# EAGLE schematic projekt_oswietlenia (EAGLE 8.5.2)

## Sheet 1 of 3
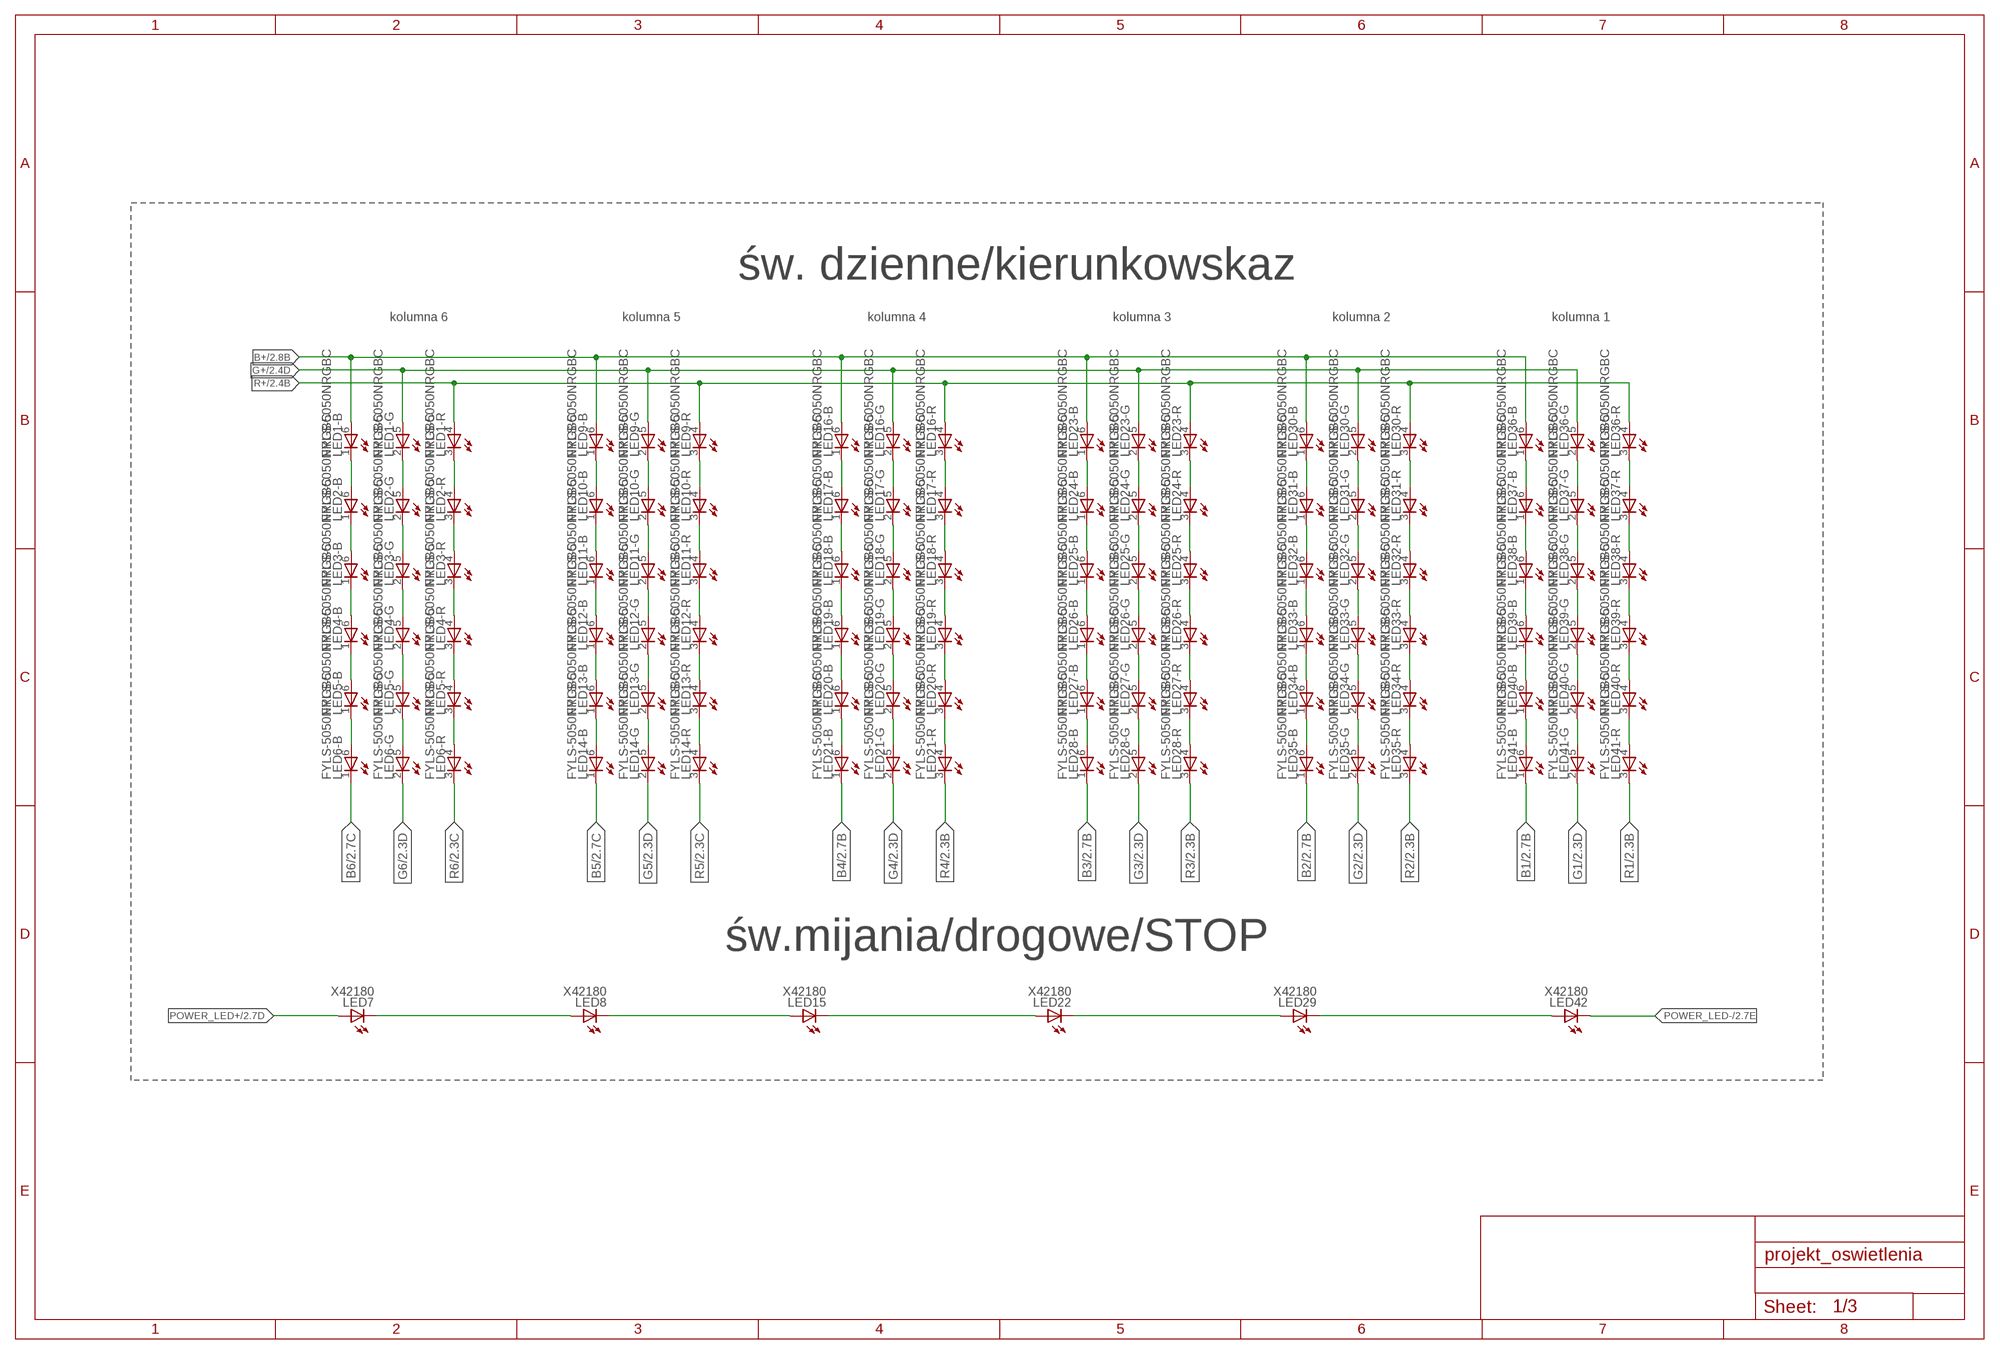
[diagram p0: schematic, sheet 1]

### Parts
LED1  FYLS-5050NRGBC  OVSTRGBBCR8  [OVSTRGBBCR8]
LED2  FYLS-5050NRGBC  OVSTRGBBCR8  [OVSTRGBBCR8]
LED3  FYLS-5050NRGBC  OVSTRGBBCR8  [OVSTRGBBCR8]
LED4  FYLS-5050NRGBC  OVSTRGBBCR8  [OVSTRGBBCR8]
LED5  FYLS-5050NRGBC  OVSTRGBBCR8  [OVSTRGBBCR8]
LED6  FYLS-5050NRGBC  OVSTRGBBCR8  [OVSTRGBBCR8]
LED7  X42180  [Z-POWER-LED-DOME-TYPE]
LED8  X42180  [Z-POWER-LED-DOME-TYPE]
LED9  FYLS-5050NRGBC  OVSTRGBBCR8  [OVSTRGBBCR8]
LED10  FYLS-5050NRGBC  OVSTRGBBCR8  [OVSTRGBBCR8]
LED11  FYLS-5050NRGBC  OVSTRGBBCR8  [OVSTRGBBCR8]
LED12  FYLS-5050NRGBC  OVSTRGBBCR8  [OVSTRGBBCR8]
LED13  FYLS-5050NRGBC  OVSTRGBBCR8  [OVSTRGBBCR8]
LED14  FYLS-5050NRGBC  OVSTRGBBCR8  [OVSTRGBBCR8]
LED15  X42180  [Z-POWER-LED-DOME-TYPE]
LED16  FYLS-5050NRGBC  OVSTRGBBCR8  [OVSTRGBBCR8]
LED17  FYLS-5050NRGBC  OVSTRGBBCR8  [OVSTRGBBCR8]
LED18  FYLS-5050NRGBC  OVSTRGBBCR8  [OVSTRGBBCR8]
LED19  FYLS-5050NRGBC  OVSTRGBBCR8  [OVSTRGBBCR8]
LED20  FYLS-5050NRGBC  OVSTRGBBCR8  [OVSTRGBBCR8]
LED21  FYLS-5050NRGBC  OVSTRGBBCR8  [OVSTRGBBCR8]
LED22  X42180  [Z-POWER-LED-DOME-TYPE]
LED23  FYLS-5050NRGBC  OVSTRGBBCR8  [OVSTRGBBCR8]
LED24  FYLS-5050NRGBC  OVSTRGBBCR8  [OVSTRGBBCR8]
LED25  FYLS-5050NRGBC  OVSTRGBBCR8  [OVSTRGBBCR8]
LED26  FYLS-5050NRGBC  OVSTRGBBCR8  [OVSTRGBBCR8]
LED27  FYLS-5050NRGBC  OVSTRGBBCR8  [OVSTRGBBCR8]
LED28  FYLS-5050NRGBC  OVSTRGBBCR8  [OVSTRGBBCR8]
LED29  X42180  [Z-POWER-LED-DOME-TYPE]
LED30  FYLS-5050NRGBC  OVSTRGBBCR8  [OVSTRGBBCR8]
LED31  FYLS-5050NRGBC  OVSTRGBBCR8  [OVSTRGBBCR8]
LED32  FYLS-5050NRGBC  OVSTRGBBCR8  [OVSTRGBBCR8]
LED33  FYLS-5050NRGBC  OVSTRGBBCR8  [OVSTRGBBCR8]
LED34  FYLS-5050NRGBC  OVSTRGBBCR8  [OVSTRGBBCR8]
LED35  FYLS-5050NRGBC  OVSTRGBBCR8  [OVSTRGBBCR8]
LED36  FYLS-5050NRGBC  OVSTRGBBCR8  [OVSTRGBBCR8]
LED37  FYLS-5050NRGBC  OVSTRGBBCR8  [OVSTRGBBCR8]
LED38  FYLS-5050NRGBC  OVSTRGBBCR8  [OVSTRGBBCR8]
LED39  FYLS-5050NRGBC  OVSTRGBBCR8  [OVSTRGBBCR8]
LED40  FYLS-5050NRGBC  OVSTRGBBCR8  [OVSTRGBBCR8]
LED41  FYLS-5050NRGBC  OVSTRGBBCR8  [OVSTRGBBCR8]
LED42  X42180  [Z-POWER-LED-DOME-TYPE]

### Nets
B1: LED41.1(-B:C) ; also sheet 2
B2: LED35.1(-B:C) ; also sheet 2
B3: LED28.1(-B:C) ; also sheet 2
B4: LED21.1(-B:C) ; also sheet 2
B5: LED14.1(-B:C) ; also sheet 2
B6: LED6.1(-B:C) ; also sheet 2
B+: LED1.6(-B:A) LED9.6(-B:A) LED16.6(-B:A) LED23.6(-B:A) LED30.6(-B:A) LED36.6(-B:A) ; also sheet 2
G1: LED41.2(-G:C) ; also sheet 2
G2: LED35.2(-G:C) ; also sheet 2
G3: LED28.2(-G:C) ; also sheet 2
G4: LED21.2(-G:C) ; also sheet 2
G5: LED14.2(-G:C) ; also sheet 2
G6: LED6.2(-G:C) ; also sheet 2
G+: LED1.5(-G:A) LED9.5(-G:A) LED16.5(-G:A) LED23.5(-G:A) LED30.5(-G:A) LED36.5(-G:A) ; also sheet 2
N$1: LED13.3(-R:C) LED14.4(-R:A)
N$2: LED13.2(-G:C) LED14.5(-G:A)
N$3: LED13.1(-B:C) LED14.6(-B:A)
N$4: LED12.3(-R:C) LED13.4(-R:A)
N$5: LED12.2(-G:C) LED13.5(-G:A)
N$6: LED12.1(-B:C) LED13.6(-B:A)
N$7: LED11.1(-B:C) LED12.6(-B:A)
N$8: LED11.2(-G:C) LED12.5(-G:A)
N$9: LED11.3(-R:C) LED12.4(-R:A)
N$10: LED10.3(-R:C) LED11.4(-R:A)
N$11: LED10.2(-G:C) LED11.5(-G:A)
N$12: LED29.C LED42.A
N$13: LED10.1(-B:C) LED11.6(-B:A)
N$14: LED9.3(-R:C) LED10.4(-R:A)
N$15: LED9.2(-G:C) LED10.5(-G:A)
N$16: LED9.1(-B:C) LED10.6(-B:A)
N$17: LED5.3(-R:C) LED6.4(-R:A)
N$18: LED5.2(-G:C) LED6.5(-G:A)
N$19: LED5.1(-B:C) LED6.6(-B:A)
N$20: LED4.3(-R:C) LED5.4(-R:A)
N$21: LED4.2(-G:C) LED5.5(-G:A)
N$22: LED4.1(-B:C) LED5.6(-B:A)
N$23: LED3.1(-B:C) LED4.6(-B:A)
N$24: LED3.2(-G:C) LED4.5(-G:A)
N$25: LED3.3(-R:C) LED4.4(-R:A)
N$26: LED2.3(-R:C) LED3.4(-R:A)
N$27: LED2.2(-G:C) LED3.5(-G:A)
N$28: LED2.1(-B:C) LED3.6(-B:A)
N$29: LED1.3(-R:C) LED2.4(-R:A)
N$30: LED1.2(-G:C) LED2.5(-G:A)
N$31: LED1.1(-B:C) LED2.6(-B:A)
N$32: LED27.3(-R:C) LED28.4(-R:A)
N$33: LED27.2(-G:C) LED28.5(-G:A)
N$34: LED27.1(-B:C) LED28.6(-B:A)
N$35: LED26.3(-R:C) LED27.4(-R:A)
N$36: LED26.2(-G:C) LED27.5(-G:A)
N$37: LED26.1(-B:C) LED27.6(-B:A)
N$38: LED25.1(-B:C) LED26.6(-B:A)
N$39: LED25.2(-G:C) LED26.5(-G:A)
N$40: LED25.3(-R:C) LED26.4(-R:A)
N$41: LED24.3(-R:C) LED25.4(-R:A)
N$42: LED24.2(-G:C) LED25.5(-G:A)
N$43: LED24.1(-B:C) LED25.6(-B:A)
N$44: LED23.3(-R:C) LED24.4(-R:A)
N$45: LED23.2(-G:C) LED24.5(-G:A)
N$46: LED23.1(-B:C) LED24.6(-B:A)
N$47: LED20.3(-R:C) LED21.4(-R:A)
N$48: LED20.2(-G:C) LED21.5(-G:A)
N$49: LED20.1(-B:C) LED21.6(-B:A)
N$50: LED19.3(-R:C) LED20.4(-R:A)
N$51: LED19.2(-G:C) LED20.5(-G:A)
N$52: LED19.1(-B:C) LED20.6(-B:A)
N$53: LED18.1(-B:C) LED19.6(-B:A)
N$54: LED18.2(-G:C) LED19.5(-G:A)
N$55: LED18.3(-R:C) LED19.4(-R:A)
N$56: LED17.3(-R:C) LED18.4(-R:A)
N$57: LED17.2(-G:C) LED18.5(-G:A)
N$58: LED17.1(-B:C) LED18.6(-B:A)
N$59: LED16.3(-R:C) LED17.4(-R:A)
N$60: LED16.2(-G:C) LED17.5(-G:A)
N$61: LED16.1(-B:C) LED17.6(-B:A)
N$62: LED40.3(-R:C) LED41.4(-R:A)
N$63: LED40.2(-G:C) LED41.5(-G:A)
N$64: LED40.1(-B:C) LED41.6(-B:A)
N$65: LED39.3(-R:C) LED40.4(-R:A)
N$66: LED39.2(-G:C) LED40.5(-G:A)
N$67: LED39.1(-B:C) LED40.6(-B:A)
N$68: LED38.1(-B:C) LED39.6(-B:A)
N$69: LED38.2(-G:C) LED39.5(-G:A)
N$70: LED38.3(-R:C) LED39.4(-R:A)
N$71: LED37.3(-R:C) LED38.4(-R:A)
N$72: LED37.2(-G:C) LED38.5(-G:A)
N$73: LED37.1(-B:C) LED38.6(-B:A)
N$74: LED36.3(-R:C) LED37.4(-R:A)
N$75: LED36.2(-G:C) LED37.5(-G:A)
N$76: LED36.1(-B:C) LED37.6(-B:A)
N$77: LED34.3(-R:C) LED35.4(-R:A)
N$78: LED34.2(-G:C) LED35.5(-G:A)
N$79: LED34.1(-B:C) LED35.6(-B:A)
N$80: LED33.3(-R:C) LED34.4(-R:A)
N$81: LED33.2(-G:C) LED34.5(-G:A)
N$82: LED33.1(-B:C) LED34.6(-B:A)
N$83: LED32.1(-B:C) LED33.6(-B:A)
N$84: LED32.2(-G:C) LED33.5(-G:A)
N$85: LED32.3(-R:C) LED33.4(-R:A)
N$86: LED31.3(-R:C) LED32.4(-R:A)
N$87: LED31.2(-G:C) LED32.5(-G:A)
N$88: LED31.1(-B:C) LED32.6(-B:A)
N$89: LED30.3(-R:C) LED31.4(-R:A)
N$90: LED30.2(-G:C) LED31.5(-G:A)
N$91: LED30.1(-B:C) LED31.6(-B:A)
N$92: LED22.C LED29.A
N$93: LED15.C LED22.A
N$94: LED8.C LED15.A
N$95: LED7.C LED8.A
POWER_LED+: LED7.A ; also sheet 2
POWER_LED-: LED42.C ; also sheet 2
R1: LED41.3(-R:C) ; also sheet 2
R2: LED35.3(-R:C) ; also sheet 2
R3: LED28.3(-R:C) ; also sheet 2
R4: LED21.3(-R:C) ; also sheet 2
R5: LED14.3(-R:C) ; also sheet 2
R6: LED6.3(-R:C) ; also sheet 2
R+: LED1.4(-R:A) LED9.4(-R:A) LED16.4(-R:A) LED23.4(-R:A) LED30.4(-R:A) LED36.4(-R:A) ; also sheet 2

### Notes on the sheet
- św. dzienne/kierunkowskaz
- kolumna 6 | kolumna 5 | kolumna 4 | kolumna 3 | kolumna 2 | kolumna 1
- św.mijania/drogowe/STOP

## Sheet 2 of 3
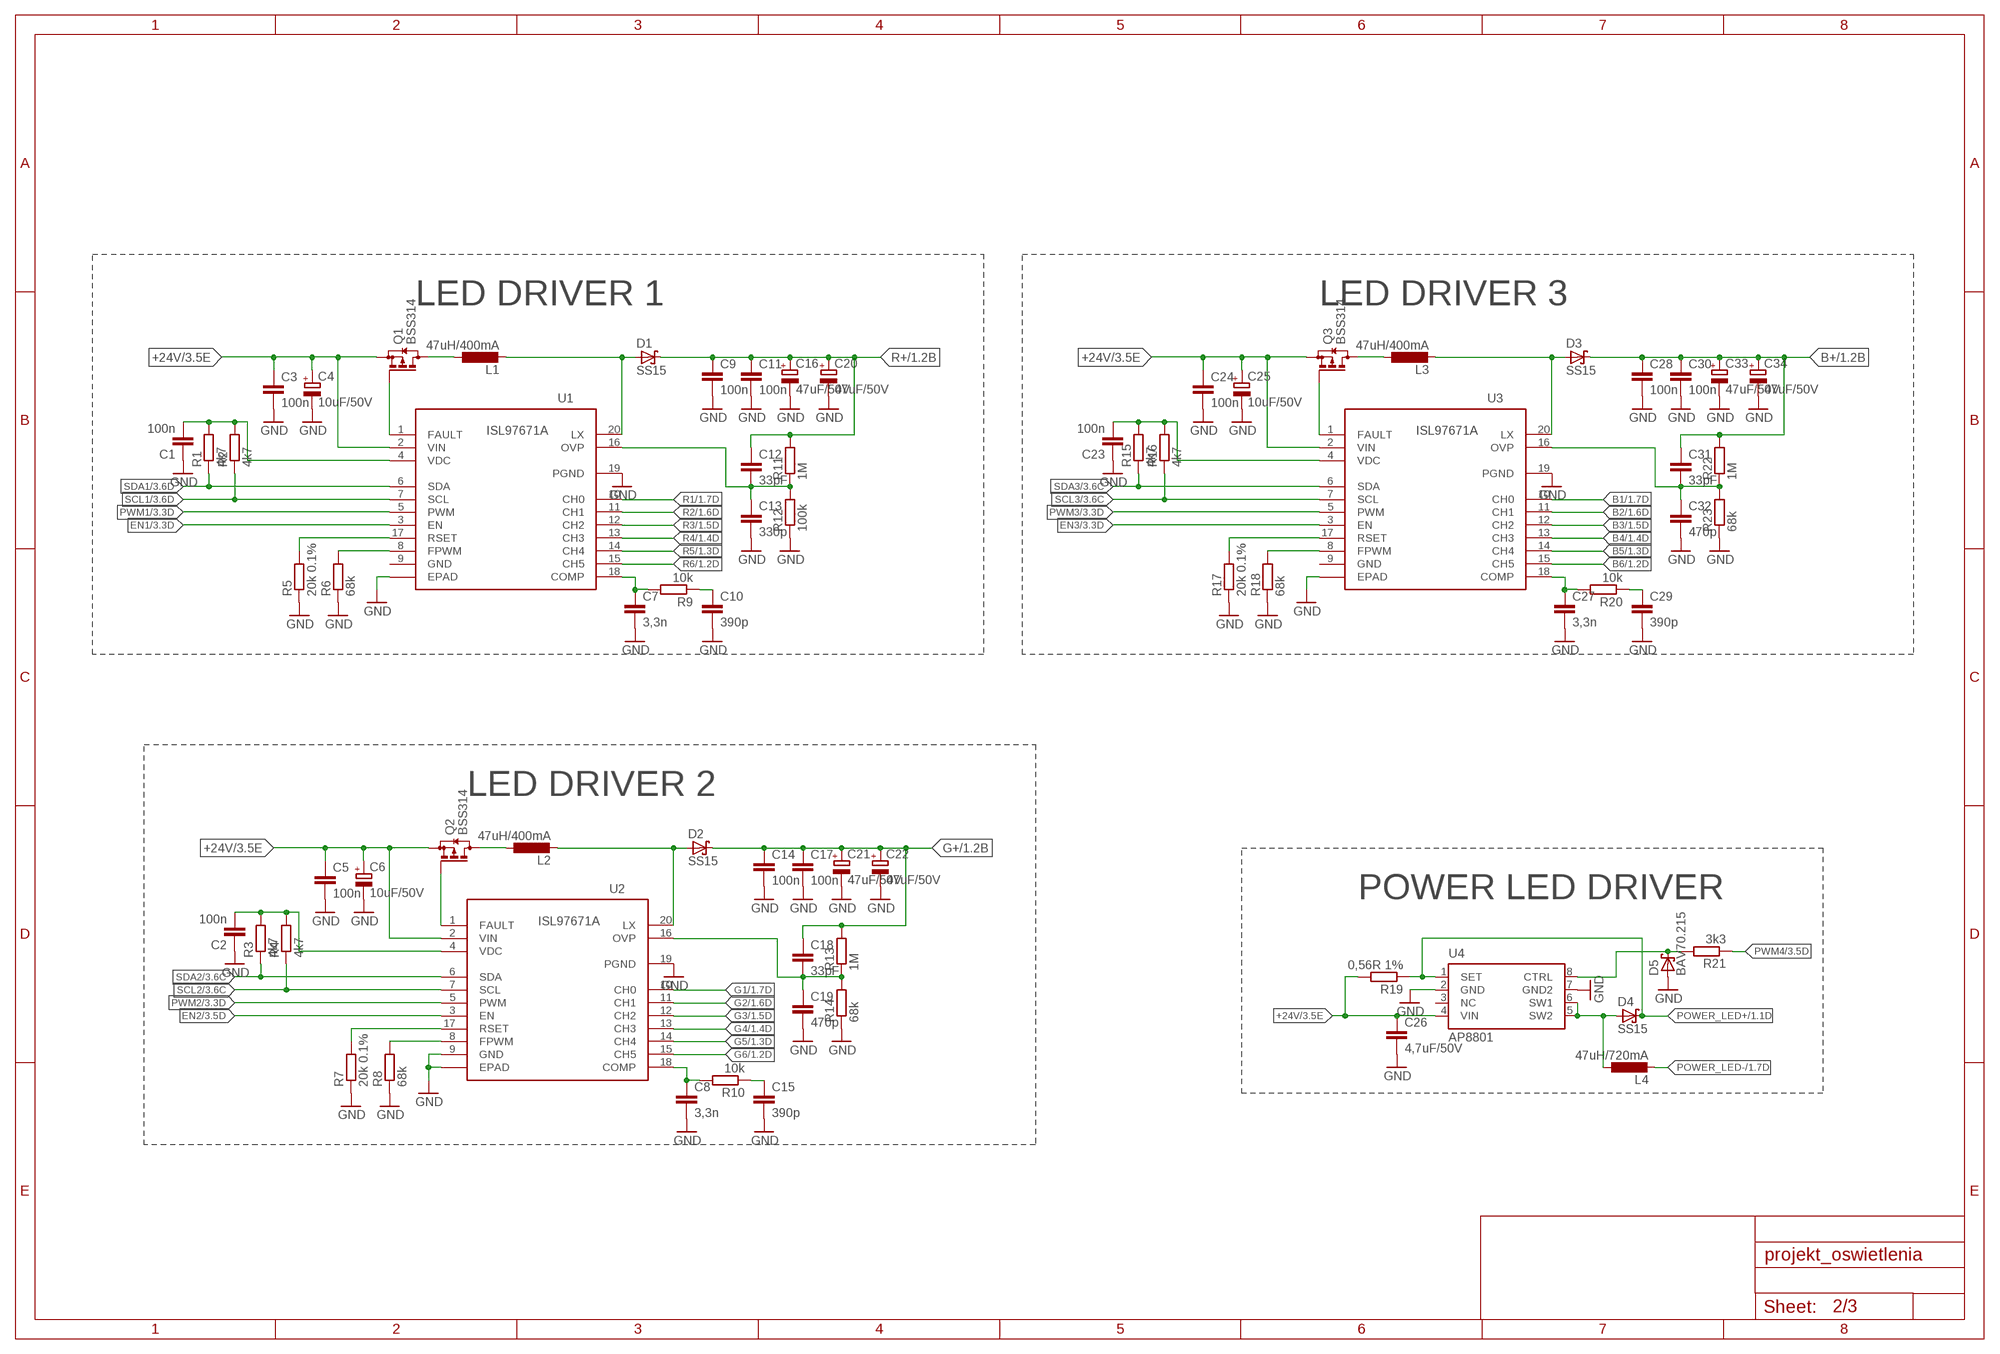
[diagram p1: schematic, sheet 2]

### Parts
C1  100n  C-EUC0603  [C0603]
C2  100n  C-EUC0603  [C0603]
C3  100n  C-EUC0603  [C0603]
C4  10uF/50V  CPOL-EU153CLV-0605  [153CLV-0605]
C5  100n  C-EUC0603  [C0603]
C6  10uF/50V  CPOL-EU153CLV-0605  [153CLV-0605]
C7  3,3n  C-EUC0603  [C0603]
C8  3,3n  C-EUC0603  [C0603]
C9  100n  C-EUC0603  [C0603]
C10  390p  C-EUC0603  [C0603]
C11  100n  C-EUC0603  [C0603]
C12  33pF  C-EUC0603  [C0603]
C13  330p  C-EUC0603  [C0603]
C14  100n  C-EUC0603  [C0603]
C15  390p  C-EUC0603  [C0603]
C16  47uF/50V  CPOL-EU153CLV-0605  [153CLV-0605]
C17  100n  C-EUC0603  [C0603]
C18  33pF  C-EUC0603  [C0603]
C19  470p  C-EUC0603  [C0603]
C20  47uF/50V  CPOL-EU153CLV-0605  [153CLV-0605]
C21  47uF/50V  CPOL-EU153CLV-0605  [153CLV-0605]
C22  47uF/50V  CPOL-EU153CLV-0605  [153CLV-0605]
C23  100n  C-EUC0603  [C0603]
C24  100n  C-EUC0603  [C0603]
C25  10uF/50V  CPOL-EU153CLV-0605  [153CLV-0605]
C26  4,7uF/50V  C-EUC0603  [C0603]
C27  3,3n  C-EUC0603  [C0603]
C28  100n  C-EUC0603  [C0603]
C29  390p  C-EUC0603  [C0603]
C30  100n  C-EUC0603  [C0603]
C31  33pF  C-EUC0603  [C0603]
C32  470p  C-EUC0603  [C0603]
C33  47uF/50V  CPOL-EU153CLV-0605  [153CLV-0605]
C34  47uF/50V  CPOL-EU153CLV-0605  [153CLV-0605]
D1  SS15  [DO-214AC]
D2  SS15  [DO-214AC]
D3  SS15  [DO-214AC]
D4  SS15  [DO-214AC]
D5  BAV70.215  BAS40  [SOT23]
L1  47uH/400mA  L-EUWE-TPC  [POWER-CHOKE_WE-TPC]
L2  47uH/400mA  L-EUWE-TPC  [POWER-CHOKE_WE-TPC]
L3  47uH/400mA  L-EUWE-TPC  [POWER-CHOKE_WE-TPC]
L4  47uH/720mA  L-EUWE-TPC  [POWER-CHOKE_WE-TPC]
Q1  BSS314  BSS84  [SOT23]
Q2  BSS314  BSS84  [SOT23]
Q3  BSS314  BSS84  [SOT23]
R1  4k7  R-EU_R0603  [R0603]
R2  4k7  R-EU_R0603  [R0603]
R3  4k7  R-EU_R0603  [R0603]
R4  4k7  R-EU_R0603  [R0603]
R5  20k 0.1%  R-EU_R0603  [R0603]
R6  68k  R-EU_R0603  [R0603]
R7  20k 0.1%  R-EU_R0603  [R0603]
R8  68k  R-EU_R0603  [R0603]
R9  10k  R-EU_R0603  [R0603]
R10  10k  R-EU_R0603  [R0603]
R11  1M  R-EU_R0603  [R0603]
R12  100k  R-EU_R0603  [R0603]
R13  1M  R-EU_R0603  [R0603]
R14  68k  R-EU_R0603  [R0603]
R15  4k7  R-EU_R0603  [R0603]
R16  4k7  R-EU_R0603  [R0603]
R17  20k 0.1%  R-EU_R0603  [R0603]
R18  68k  R-EU_R0603  [R0603]
R19  0,56R 1%  R-EU_R0603  [R0603]
R20  10k  R-EU_R0603  [R0603]
R21  3k3  R-EU_R0603  [R0603]
R22  1M  R-EU_R0603  [R0603]
R23  68k  R-EU_R0603  [R0603]
U1  ISL97671A  [QFN20]
U2  ISL97671A  [QFN20]
U3  ISL97671A  [QFN20]
U4  AP8801  [SOP-08]

### Nets
+24V: C3.1 C4.+ C5.1 C6.+ C24.1 C25.+ C26.1 Q1.2(S) Q2.2(S) Q3.2(S) R19.2 U1.2(VIN) U2.2(VIN) U3.2(VIN) U4.4(VIN) ; also sheet 3
B1: U3.10(CH0) ; also sheet 1
B2: U3.11(CH1) ; also sheet 1
B3: U3.12(CH2) ; also sheet 1
B4: U3.13(CH3) ; also sheet 1
B5: U3.14(CH4) ; also sheet 1
B6: U3.15(CH5) ; also sheet 1
B+: C28.1 C30.1 C31.1 C33.+ C34.+ D3.C R22.2 ; also sheet 1
EN1: U1.3(EN) ; also sheet 3
EN2: U2.3(EN) ; also sheet 3
EN3: U3.3(EN) ; also sheet 3
G1: U2.10(CH0) ; also sheet 1
G2: U2.11(CH1) ; also sheet 1
G3: U2.12(CH2) ; also sheet 1
G4: U2.13(CH3) ; also sheet 1
G5: U2.14(CH4) ; also sheet 1
G6: U2.15(CH5) ; also sheet 1
G+: C14.1 C17.1 C18.1 C21.+ C22.+ D2.C R13.2 ; also sheet 1
GND: C1.1 C2.1 C3.2 C4.- C5.2 C6.- C7.2 C8.2 C9.2 C10.2 C11.2 C13.2 C14.2 C15.2 C16.- C17.2 C19.2 C20.- C21.- C22.- C23.1 C24.2 C25.- C26.2 C27.2 C28.2 C29.2 C30.2 C32.2 C33.- C34.- D5.1(A) R5.1 R6.1 R7.1 R8.1 R12.1 R14.1 R17.1 R18.1 R23.1 U1.19(PGND) U1.EPAD U2.9(GND) U2.19(PGND) U2.EPAD U3.19(PGND) U3.EPAD U4.2(GND) U4.7(GND2) ; also sheet 3
N$96: D4.A L4.1 U4.5(SW2) U4.6(SW1)
N$106: D5.3(C) R21.2 U4.8(CTRL)
N$114: Q3.1(G) U3.1(FAULT)
N$115: L3.1 Q3.3(D)
N$116: D3.A L3.2 U3.20(LX)
N$117: C31.2 C32.1 R22.1 R23.2 U3.16(OVP)
N$118: C27.1 R20.2 U3.18(COMP)
N$119: C29.1 R20.1
N$120: R18.2 U3.8(FPWM)
N$121: R17.2 U3.17(RSET)
N$122: Q1.1(G) U1.1(FAULT)
N$125: L1.1 Q1.3(D)
N$126: D1.A L1.2 U1.20(LX)
N$127: C12.2 C13.1 R11.1 R12.2 U1.16(OVP)
N$128: C7.1 R9.2 U1.18(COMP)
N$129: C10.1 R9.1
N$130: R6.2 U1.8(FPWM)
N$131: C23.2 R15.2 R16.2 U3.4(VDC)
N$133: R5.2 U1.17(RSET)
N$134: C1.2 R1.2 R2.2 U1.4(VDC)
N$138: Q2.1(G) U2.1(FAULT)
N$140: L2.1 Q2.3(D)
N$141: D2.A L2.2 U2.20(LX)
N$142: C18.2 C19.1 R13.1 R14.2 U2.16(OVP)
N$143: C8.1 R10.2 U2.18(COMP)
N$144: C15.1 R10.1
N$145: R8.2 U2.8(FPWM)
N$146: R7.2 U2.17(RSET)
N$147: C2.2 R3.2 R4.2 U2.4(VDC)
POWER_LED+: D4.C R19.1 U4.1(SET) ; also sheet 1
POWER_LED-: L4.2 ; also sheet 1
PWM1: U1.5(PWM) ; also sheet 3
PWM2: U2.5(PWM) ; also sheet 3
PWM3: U3.5(PWM) ; also sheet 3
PWM4: R21.1 ; also sheet 3
R1: U1.10(CH0) ; also sheet 1
R2: U1.11(CH1) ; also sheet 1
R3: U1.12(CH2) ; also sheet 1
R4: U1.13(CH3) ; also sheet 1
R5: U1.14(CH4) ; also sheet 1
R6: U1.15(CH5) ; also sheet 1
R+: C9.1 C11.1 C12.1 C16.+ C20.+ D1.C R11.2 ; also sheet 1
SCL1: R2.1 U1.7(SCL) ; also sheet 3
SCL2: R4.1 U2.7(SCL) ; also sheet 3
SCL3: R16.1 U3.7(SCL) ; also sheet 3
SDA1: R1.1 U1.6(SDA) ; also sheet 3
SDA2: R3.1 U2.6(SDA) ; also sheet 3
SDA3: R15.1 U3.6(SDA) ; also sheet 3
Unconnected: U4.3(NC)

### Notes on the sheet
- LED DRIVER 1 | LED DRIVER 3
- LED DRIVER 2
- POWER LED DRIVER

## Sheet 3 of 3
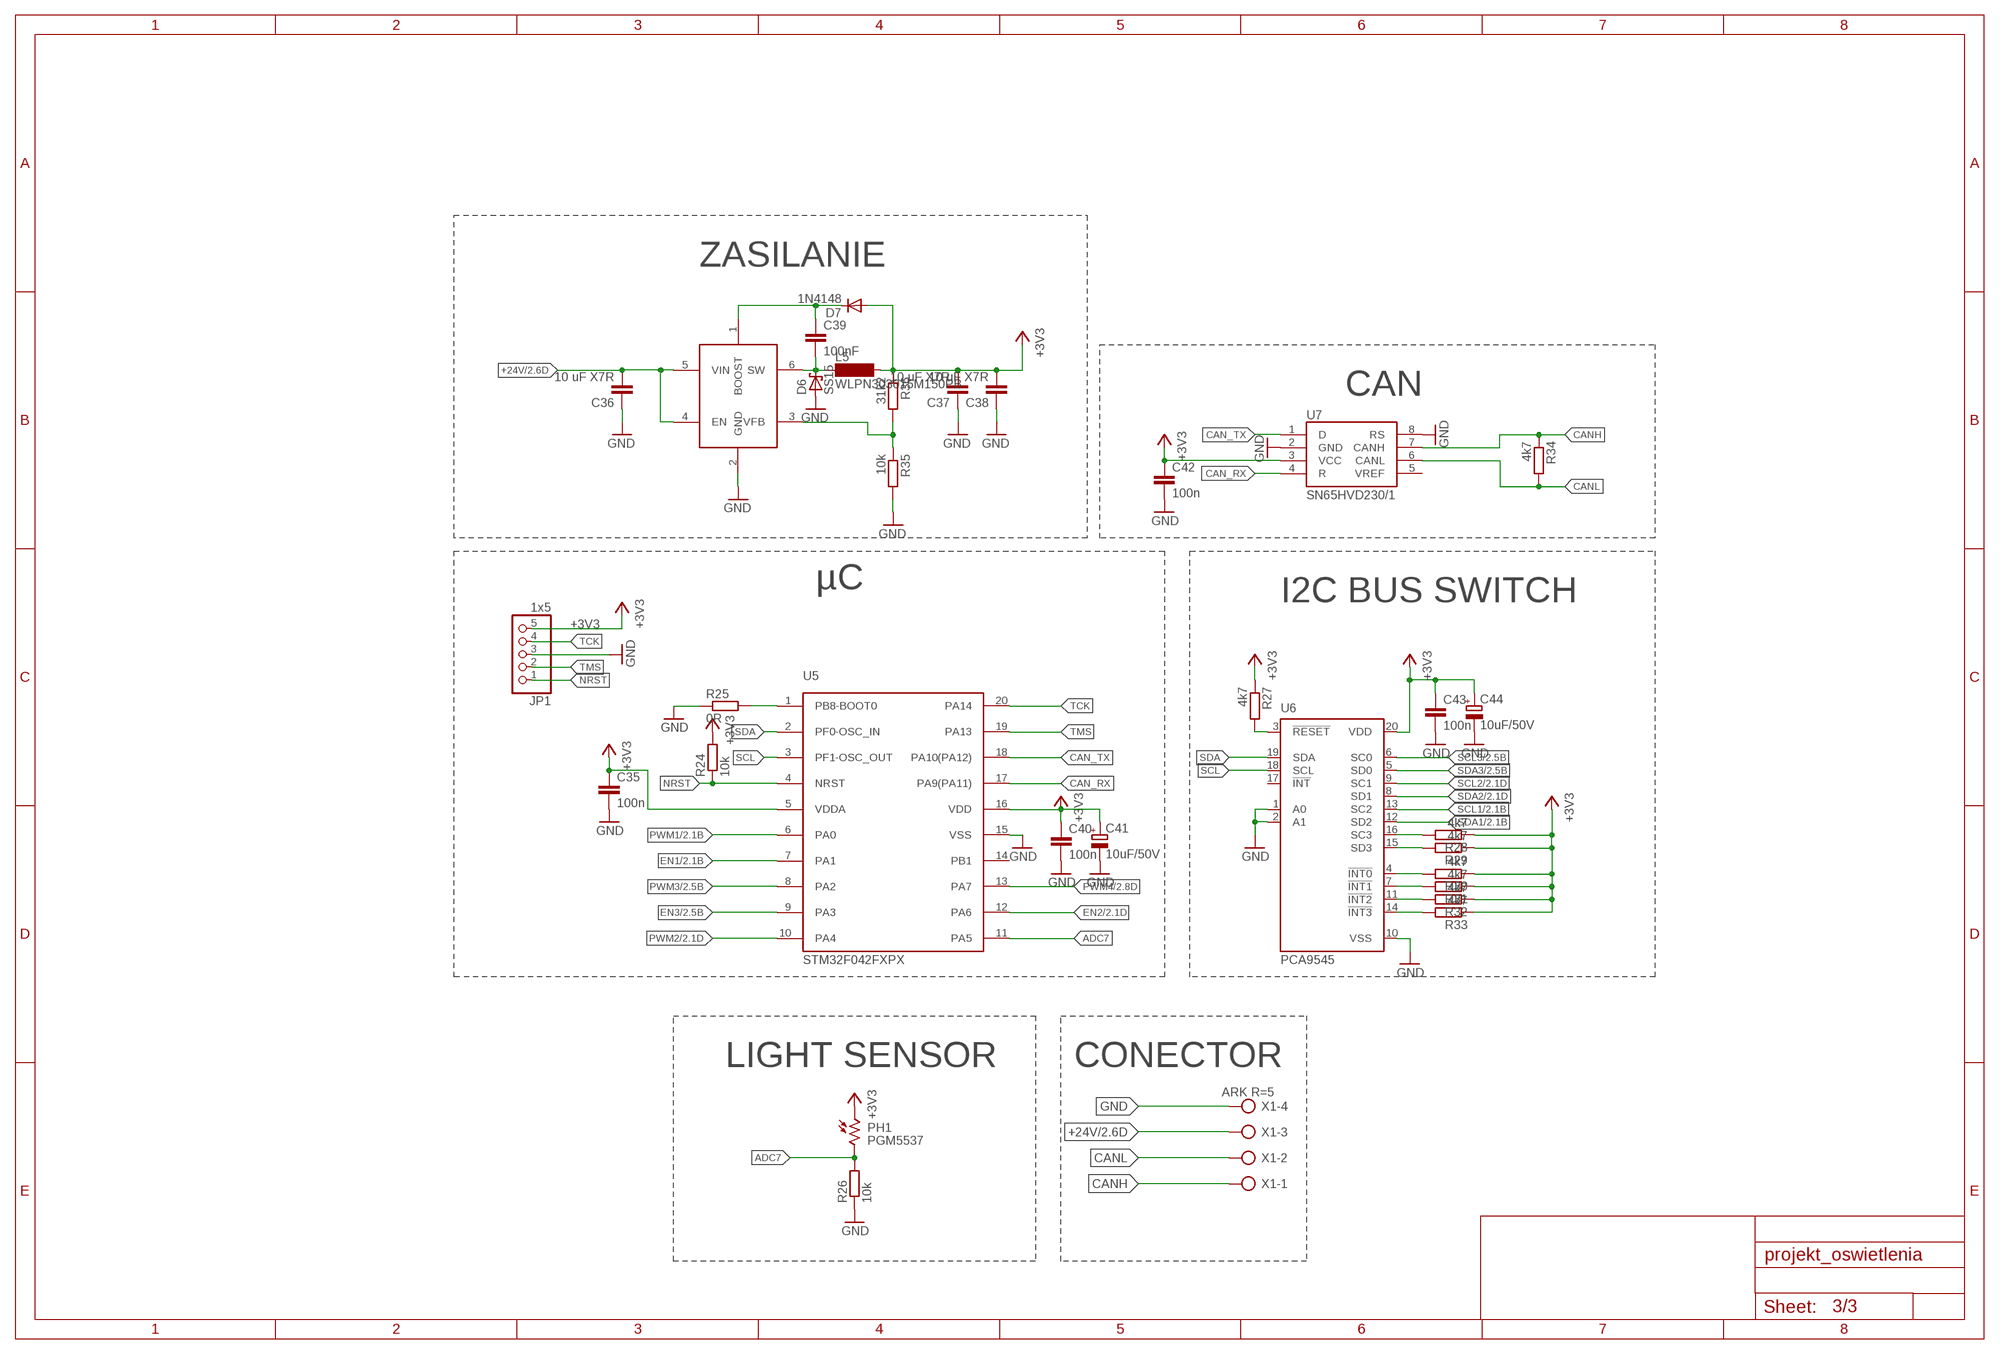
[diagram p2: schematic, sheet 3]

### Parts
C35  100n  C-EUC0603  [C0603]
C36  10 uF X7R  C-EUC0603  [C0603]
C37  10 uF X7R  C-EUC0603  [C0603]
C38  10 uF X7R  C-EUC0603  [C0603]
C39  100nF  C-EUC0603  [C0603]
C40  100n  C-EUC0603  [C0603]
C41  10uF/50V  CPOL-EU153CLV-0605  [153CLV-0605]
C42  100n  C-EUC0603  [C0603]
C43  100n  C-EUC0603  [C0603]
C44  10uF/50V  CPOL-EU153CLV-0605  [153CLV-0605]
D6  SS15  [DO-214AC]
D7  1N4148  DIODE-SMB  [SMB]
IC1  MCP16301/H  [SOT23-6]
JP1  1x5  PINHD-1X5  [1X05]
L5  WLPN303015M150PB  MS50  [MS50]
PH1  PGM5537  VT80N1  [VT800]
R24  10k  R-EU_R0603  [R0603]
R25  0R  R-EU_R0603  [R0603]
R26  10k  R-EU_R0603  [R0603]
R27  4k7  R-EU_R0603  [R0603]
R28  4k7  R-EU_R0603  [R0603]
R29  4k7  R-EU_R0603  [R0603]
R30  4k7  R-EU_R0603  [R0603]
R31  4k7  R-EU_R0603  [R0603]
R32  4k7  R-EU_R0603  [R0603]
R33  4k7  R-EU_R0603  [R0603]
R34  4k7  R-EU_R0603  [R0603]
R35  10k  R-EU_R0603  [R0603]
R36  31k2  R-EU_R0603  [R0603]
U5  STM32F042FXPX  [TSSOP20]
U6  PCA9545  [SO20W]
U7  SN65HVD230/1  [SO8]
X1  ARK R=5  AK500/4  [AK500/4]

### Nets
+3V3: C35.1 C37.2 C38.2 C40.1 C41.+ C42.1 C43.1 C44.+ D7.A JP1.5 L5.2 PH1.1 R24.2 R27.1 R28.1 R29.1 R30.1 R31.1 R32.1 R33.1 R36.1 U5.5(VDDA) U5.16(VDD) U6.20(VDD) U7.3(VCC)
+24V: C36.2 IC1.4(EN) IC1.5(VIN) X1.3 ; also sheet 2
ADC7: PH1.2 R26.2 U5.11(PA5)
CAN_RX: U5.17(PA9(PA11)) U7.4(R)
CAN_TX: U5.18(PA10(PA12)) U7.1(D)
CANH: R34.1 U7.7(CANH) X1.1
CANL: R34.2 U7.6(CANL) X1.2
EN1: U5.7(PA1) ; also sheet 2
EN2: U5.12(PA6) ; also sheet 2
EN3: U5.9(PA3) ; also sheet 2
GND: C35.2 C36.1 C37.1 C38.1 C40.2 C41.- C42.2 C43.2 C44.- D6.A IC1.2(GND) JP1.3 R25.1 R26.1 R35.2 U5.15(VSS) U6.1(A0) U6.2(A1) U6.10(VSS) U7.2(GND) U7.8(RS) X1.4 ; also sheet 2
N$97: C39.1 D7.C IC1.1(BOOST)
N$98: R33.2 U6.14(!INT3)
N$99: R32.2 U6.11(!INT2)
N$100: R31.2 U6.7(!INT1)
N$101: R30.2 U6.4(!INT0)
N$102: R29.2 U6.15(SD3)
N$103: R28.2 U6.16(SC3)
N$104: R27.2 U6.3(!RESET)
N$105: C39.2 D6.C IC1.6(SW) L5.1
N$107: IC1.3(VFB) R35.1 R36.2
N$139: R25.2 U5.1(PB8-BOOT0)
NRST: JP1.1 R24.1 U5.4(NRST)
PWM1: U5.6(PA0) ; also sheet 2
PWM2: U5.10(PA4) ; also sheet 2
PWM3: U5.8(PA2) ; also sheet 2
PWM4: U5.13(PA7) ; also sheet 2
SCL: U5.3(PF1-OSC_OUT) U6.18(SCL)
SCL1: U6.13(SC2) ; also sheet 2
SCL2: U6.9(SC1) ; also sheet 2
SCL3: U6.6(SC0) ; also sheet 2
SDA: U5.2(PF0-OSC_IN) U6.19(SDA)
SDA1: U6.12(SD2) ; also sheet 2
SDA2: U6.8(SD1) ; also sheet 2
SDA3: U6.5(SD0) ; also sheet 2
TCK: JP1.4 U5.20(PA14)
TMS: JP1.2 U5.19(PA13)
Unconnected: U5.14(PB1) U6.17(!INT) U7.5(VREF)

### Notes on the sheet
- ZASILANIE
- CAN
- µC
- I2C BUS SWITCH
- LIGHT SENSOR | CONECTOR

## Power pins joined to a net without a drawn wire
GND: U1.9(GND) U3.9(GND)

## Library data of the parts
C1-C3 C5 C7-C15 C17-C19 C23 C24 C26-C32 C35 C40 C42 C43 = resistor:C-EU: CAPACITOR, European symbol
C4 C6 C16 C20-C22 C25 C33 C34 C41 C44 = rcl:CPOL-EU: POLARIZED CAPACITOR, European symbol
C36-C39 = rcl:C-EU: CAPACITOR, European symbol
D1-D4 D6 = ss14:SS15
D5 = diode:BAS40: Silicon Schottky Diodes General-purpose diode for high-speed switching
D7 = diode:DIODE-: DIODE
IC1 = MCP16301:MCP16301/H: High-Voltage Input Integrated Switch Step-Down Regulator
JP1 = pinhead:PINHD-1X5: PIN HEADER
L1-L4 = rcl:L-EU: INDUCTOR, European symbol
L5 = inductor-neosid:MS50: INDUCTOR SMD power inductor; OC_FARNELL: unknown; OC_NEWARK: unknown
LED1-LED6 LED9-LED14 LED16-LED21 LED23-LED28 LED30-LED41 = led:OVSTRGBBCR8: Full Color PLCC6 LED OVSTRGBBCR8 Source: www.optekinc.com .. ovstrgbbcr8.pdf
LED7 LED8 LED15 LED22 LED29 LED42 = led:X42180: Z-Power LED P4 Series, Dome type Source: http://www.seoulsemicon.co.kr .. X42180.pdf
PH1 = photo-elements:VT8: Photoconductive Cell VT800 Series Source: http://optoelectronics.perkinelmer.com/content/Datasheets/DTS_vt800seriesdatasheet.pdf
Q1-Q3 = transistor-small-signal:BSS84: P-CHANNEL MOS FET
R1-R24 R26-R36 = resistor:R-EU_: RESISTOR, European symbol
R25 = rcl:R-EU_: RESISTOR, European symbol
U1-U3 = MyLibrary:ISL97671A
U4 = texas2:AP8801
U5 = MyLibrary:STM32F042FXPX
U6 = micro-philips:PCA9545
U7 = texas_intrument:SN65HVD230/1
X1 = con-ptr500:AK500/4: CONNECTOR; OC_FARNELL: unknown; OC_NEWARK: unknown